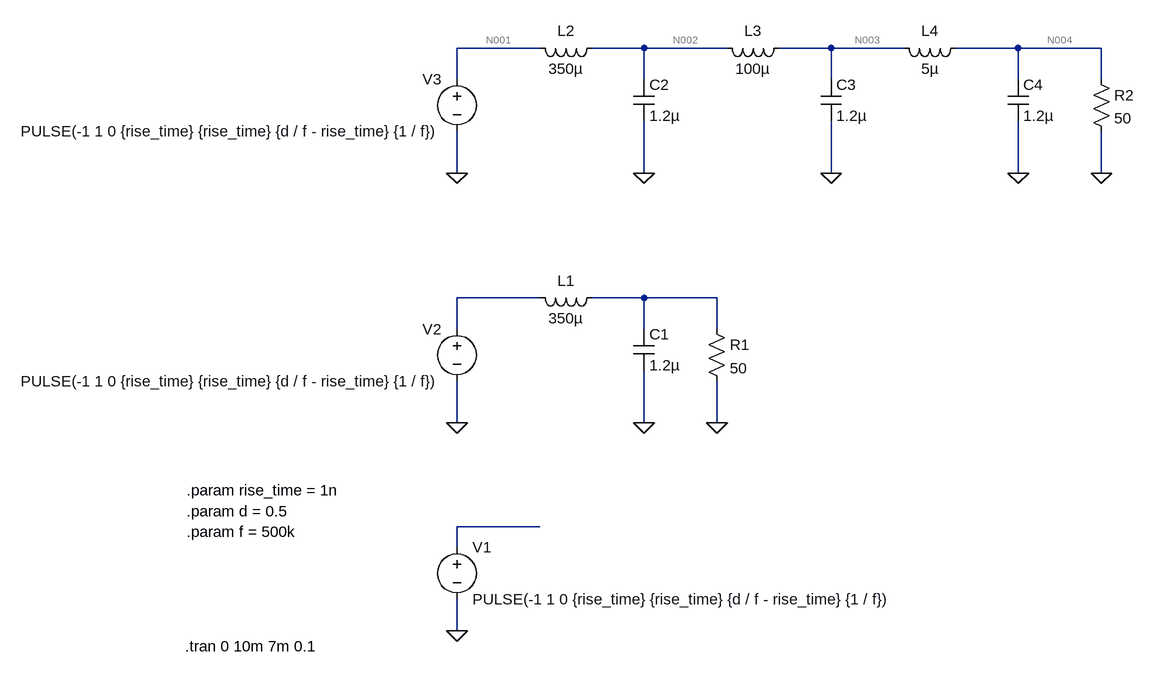
[diagram p0: schematic Draft1.asc]
Draft1.asc, the LTspice schematic file:
Version 4
SHEET 1 1224 680
WIRE 304 -624 176 -624
WIRE 464 -624 384 -624
WIRE 592 -624 464 -624
WIRE 752 -624 672 -624
WIRE 864 -624 752 -624
WIRE 1040 -624 944 -624
WIRE 1168 -624 1040 -624
WIRE 176 -576 176 -624
WIRE 464 -576 464 -624
WIRE 752 -576 752 -624
WIRE 1040 -576 1040 -624
WIRE 1168 -576 1168 -624
WIRE 176 -432 176 -496
WIRE 464 -432 464 -512
WIRE 752 -432 752 -512
WIRE 1040 -432 1040 -512
WIRE 1168 -432 1168 -496
WIRE 304 -240 176 -240
WIRE 464 -240 384 -240
WIRE 576 -240 464 -240
WIRE 176 -192 176 -240
WIRE 464 -192 464 -240
WIRE 576 -192 576 -240
WIRE 176 -48 176 -112
WIRE 464 -48 464 -128
WIRE 576 -48 576 -112
WIRE 304 112 176 112
WIRE 176 144 176 112
WIRE 176 272 176 224
FLAG 176 272 0
FLAG 176 -48 0
FLAG 464 -48 0
FLAG 576 -48 0
FLAG 176 -432 0
FLAG 464 -432 0
FLAG 1168 -432 0
FLAG 752 -432 0
FLAG 1040 -432 0
SYMBOL voltage 176 128 R0
WINDOW 123 0 0 Left 0
WINDOW 39 0 0 Left 0
SYMATTR InstName V1
SYMATTR Value PULSE(-1 1 0 {rise_time} {rise_time} {d / f - rise_time} {1 / f})
SYMBOL voltage 176 -208 M0
WINDOW 123 0 0 Left 0
WINDOW 39 0 0 Left 0
SYMATTR InstName V2
SYMATTR Value PULSE(-1 1 0 {rise_time} {rise_time} {d / f - rise_time} {1 / f})
SYMBOL ind 400 -256 R90
WINDOW 0 5 56 VBottom 2
WINDOW 3 32 56 VTop 2
SYMATTR InstName L1
SYMATTR Value 350µ
SYMBOL cap 448 -192 R0
SYMATTR InstName C1
SYMATTR Value 1.2µ
SYMBOL res 560 -208 R0
SYMATTR InstName R1
SYMATTR Value 50
SYMBOL voltage 176 -592 M0
WINDOW 123 0 0 Left 0
WINDOW 39 0 0 Left 0
SYMATTR InstName V3
SYMATTR Value PULSE(-1 1 0 {rise_time} {rise_time} {d / f - rise_time} {1 / f})
SYMBOL ind 400 -640 R90
WINDOW 0 5 56 VBottom 2
WINDOW 3 32 56 VTop 2
SYMATTR InstName L2
SYMATTR Value 350µ
SYMBOL cap 448 -576 R0
SYMATTR InstName C2
SYMATTR Value 1.2µ
SYMBOL res 1152 -592 R0
SYMATTR InstName R2
SYMATTR Value 50
SYMBOL ind 688 -640 R90
WINDOW 0 5 56 VBottom 2
WINDOW 3 32 56 VTop 2
SYMATTR InstName L3
SYMATTR Value 100µ
SYMBOL cap 736 -576 R0
SYMATTR InstName C3
SYMATTR Value 1.2µ
SYMBOL ind 960 -640 R90
WINDOW 0 5 56 VBottom 2
WINDOW 3 32 56 VTop 2
SYMATTR InstName L4
SYMATTR Value 5µ
SYMBOL cap 1024 -576 R0
SYMATTR InstName C4
SYMATTR Value 1.2µ
TEXT -240 56 Left 2 !.param rise_time = 1n
TEXT -240 88 Left 2 !.param d = 0.5
TEXT -240 120 Left 2 !.param f = 500k
TEXT -242 296 Left 2 !.tran 0 10m 7m 0.1

The netlist it stands for:
* Draft1.asc
V1 N007 0 PULSE(-1 1 0 {rise_time} {rise_time} {d / f - rise_time} {1 / f})
V2 N005 0 PULSE(-1 1 0 {rise_time} {rise_time} {d / f - rise_time} {1 / f})
L1 N006 N005 350µ
C1 N006 0 1.2µ
R1 N006 0 50
V3 N001 0 PULSE(-1 1 0 {rise_time} {rise_time} {d / f - rise_time} {1 / f})
L2 N002 N001 350µ
C2 N002 0 1.2µ
R2 N004 0 50
L3 N003 N002 100µ
C3 N003 0 1.2µ
L4 N004 N003 5µ
C4 N004 0 1.2µ
.param rise_time = 1n
.param d = 0.5
.param f = 500k
.tran 0 10m 7m 0.1
.backanno
.end

* Results of the author's LTspice run, read from the files saved beside the schematic
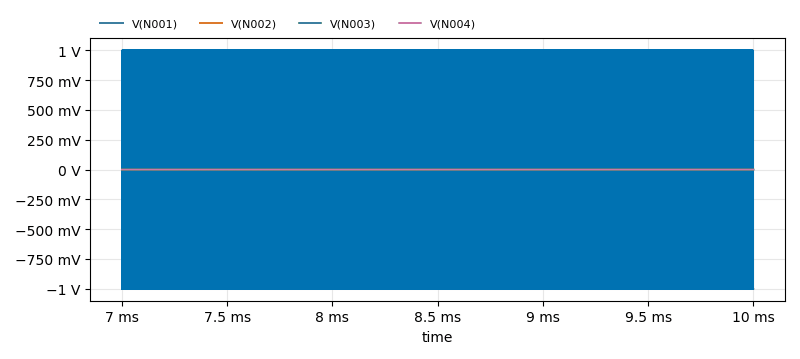
[diagram p1: Transient Analysis of Draft1.asc, plotted from the saved traces]
* Transient Analysis, 1 run:
*   V(N001): min -1.001 V, max 1.001 V, average 0 V, rms 1 V, last -1 V
*   V(N002): min -326.3 µV, max 324.9 µV, average -150.5 nV, rms 216.4 µV, last 3.573 µV
*   V(N003): min -11.98 µV, max 11.61 µV, average -31.51 nV, rms 3.615 µV, last -1.881 µV
*   V(N004): min -12.79 µV, max 12.44 µV, average -28.16 nV, rms 3.932 µV, last -1.988 µV